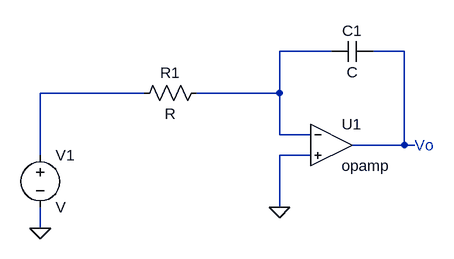
[diagram p0: schematic test.asc]
test.asc, the LTspice schematic file:
Version 4
SHEET 1 880 680
WIRE 528 -32 448 -32
WIRE 640 -32 592 -32
WIRE 240 32 80 32
WIRE 448 32 448 -32
WIRE 448 32 320 32
WIRE 448 96 448 32
WIRE 496 96 448 96
WIRE 640 112 640 -32
WIRE 640 112 560 112
WIRE 656 112 640 112
WIRE 80 128 80 32
WIRE 496 128 448 128
WIRE 448 208 448 128
WIRE 80 240 80 208
FLAG 448 208 0
FLAG 80 240 0
SYMBOL res 336 16 R90
WINDOW 0 0 56 VBottom 2
WINDOW 3 32 56 VTop 2
SYMATTR InstName R1
SYMBOL Opamps\\opamp 528 48 R0
SYMATTR InstName U1
SYMBOL cap 592 -48 R90
WINDOW 0 0 32 VBottom 2
WINDOW 3 32 32 VTop 2
SYMATTR InstName C1
SYMBOL voltage 80 112 R0
SYMATTR InstName V1
TEXT 656 112 Left 2 ;Vo

The netlist it stands for:
* test.asc
R1 N001 N003 R
XU1 N001 0 N002 opamp Aol=100K GBW=10Meg  ; pins invin noninvin out
C1 N002 N001 C
V1 N003 0 V
* Vo
.backanno
.end